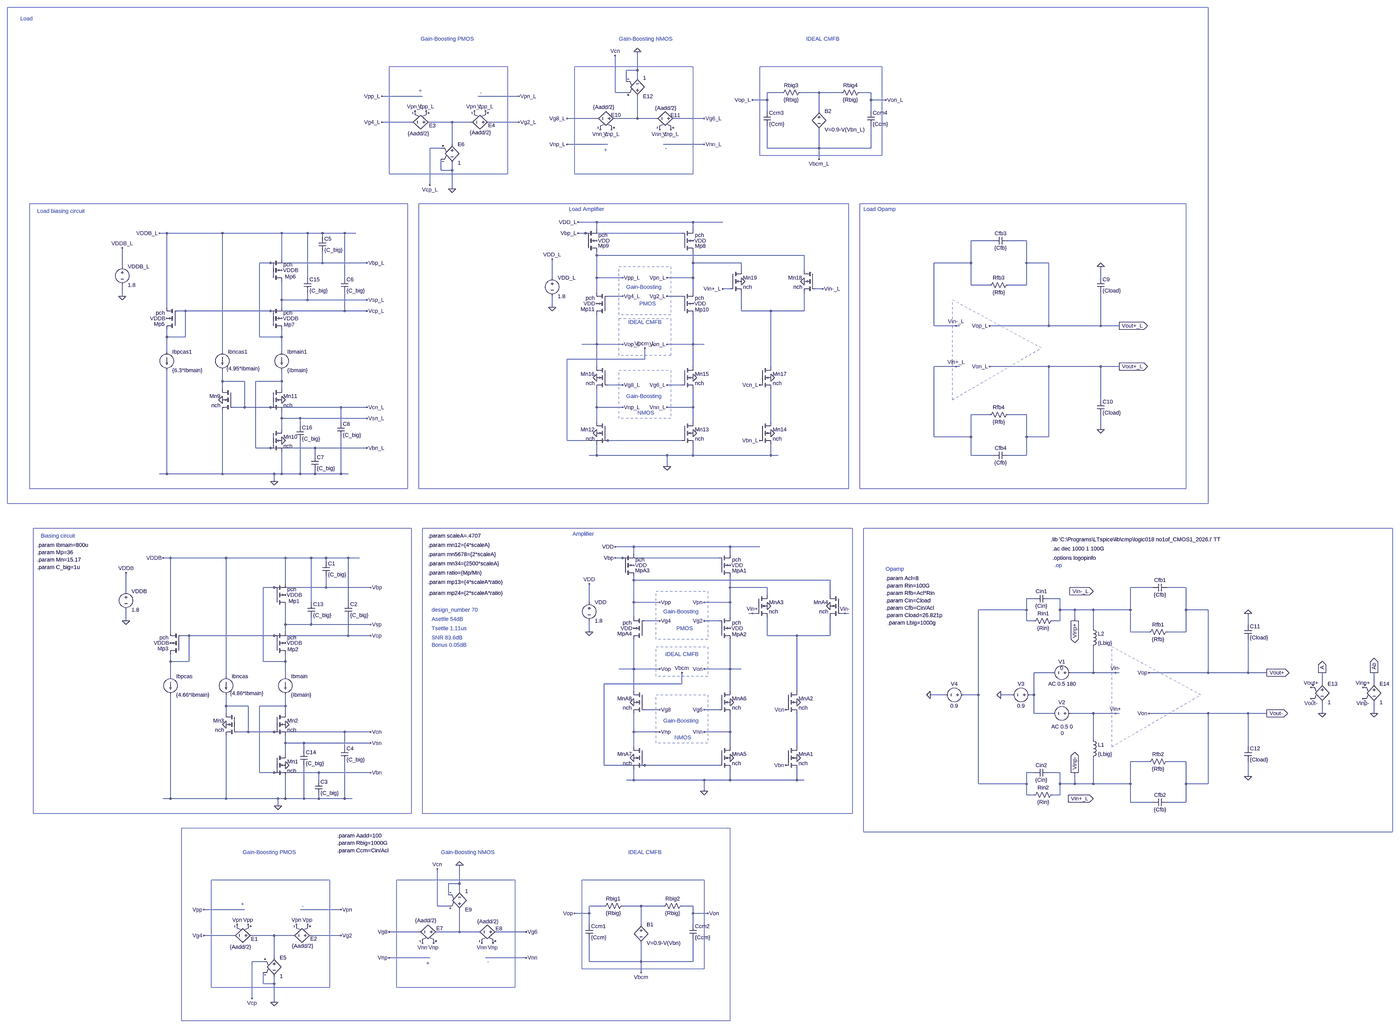
[diagram p0: schematic A_Ab.asc, whole sheet]
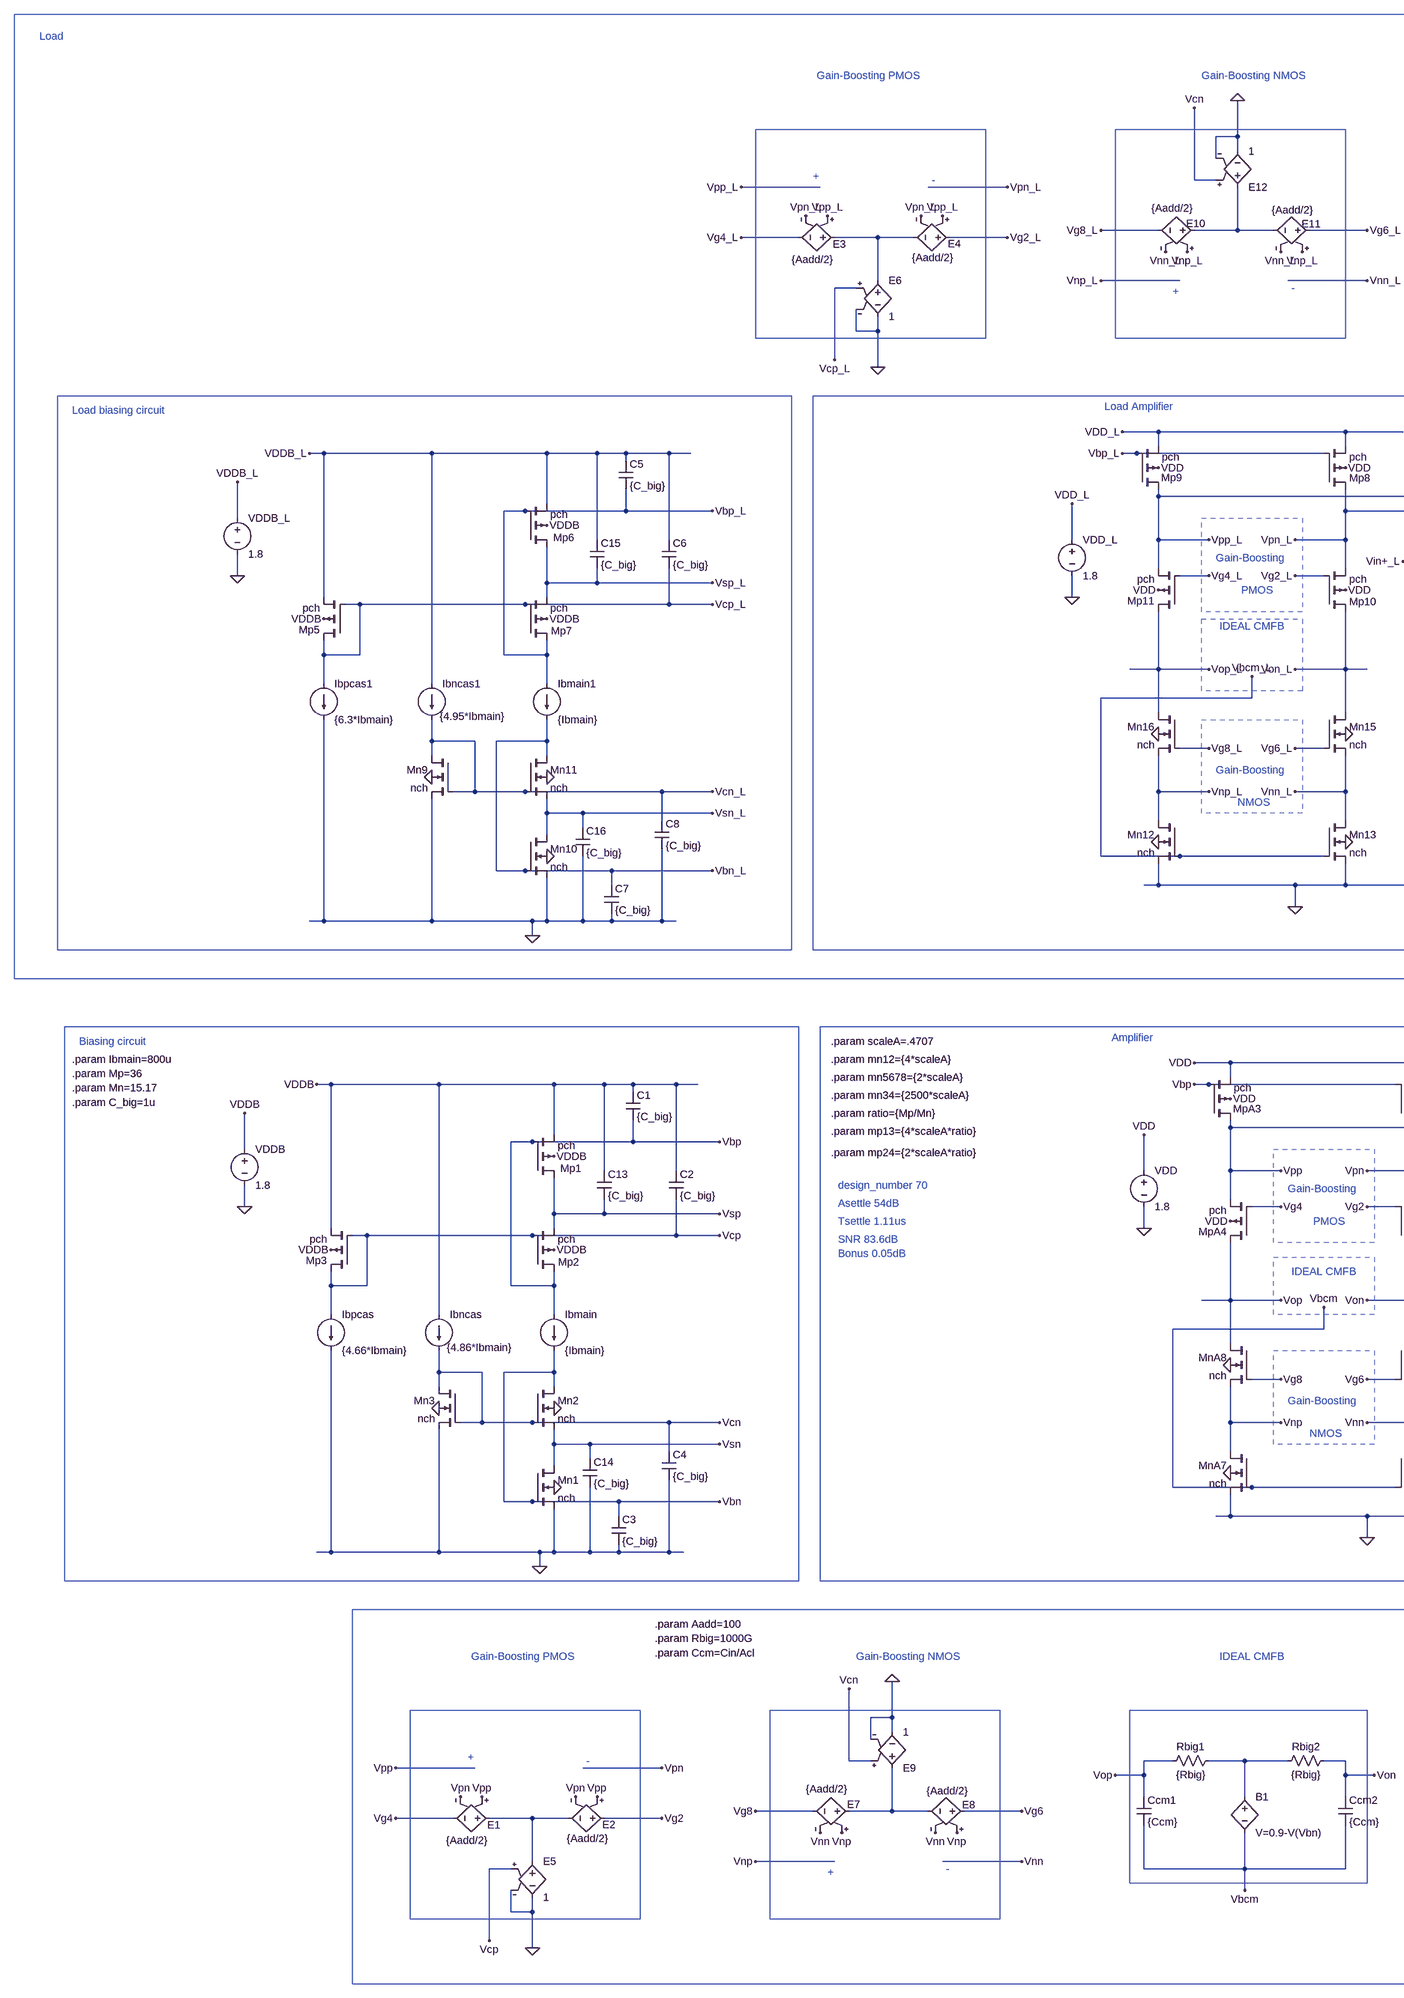
[diagram p1: schematic A_Ab.asc, part, row 1 of 1, column 1 of 2]
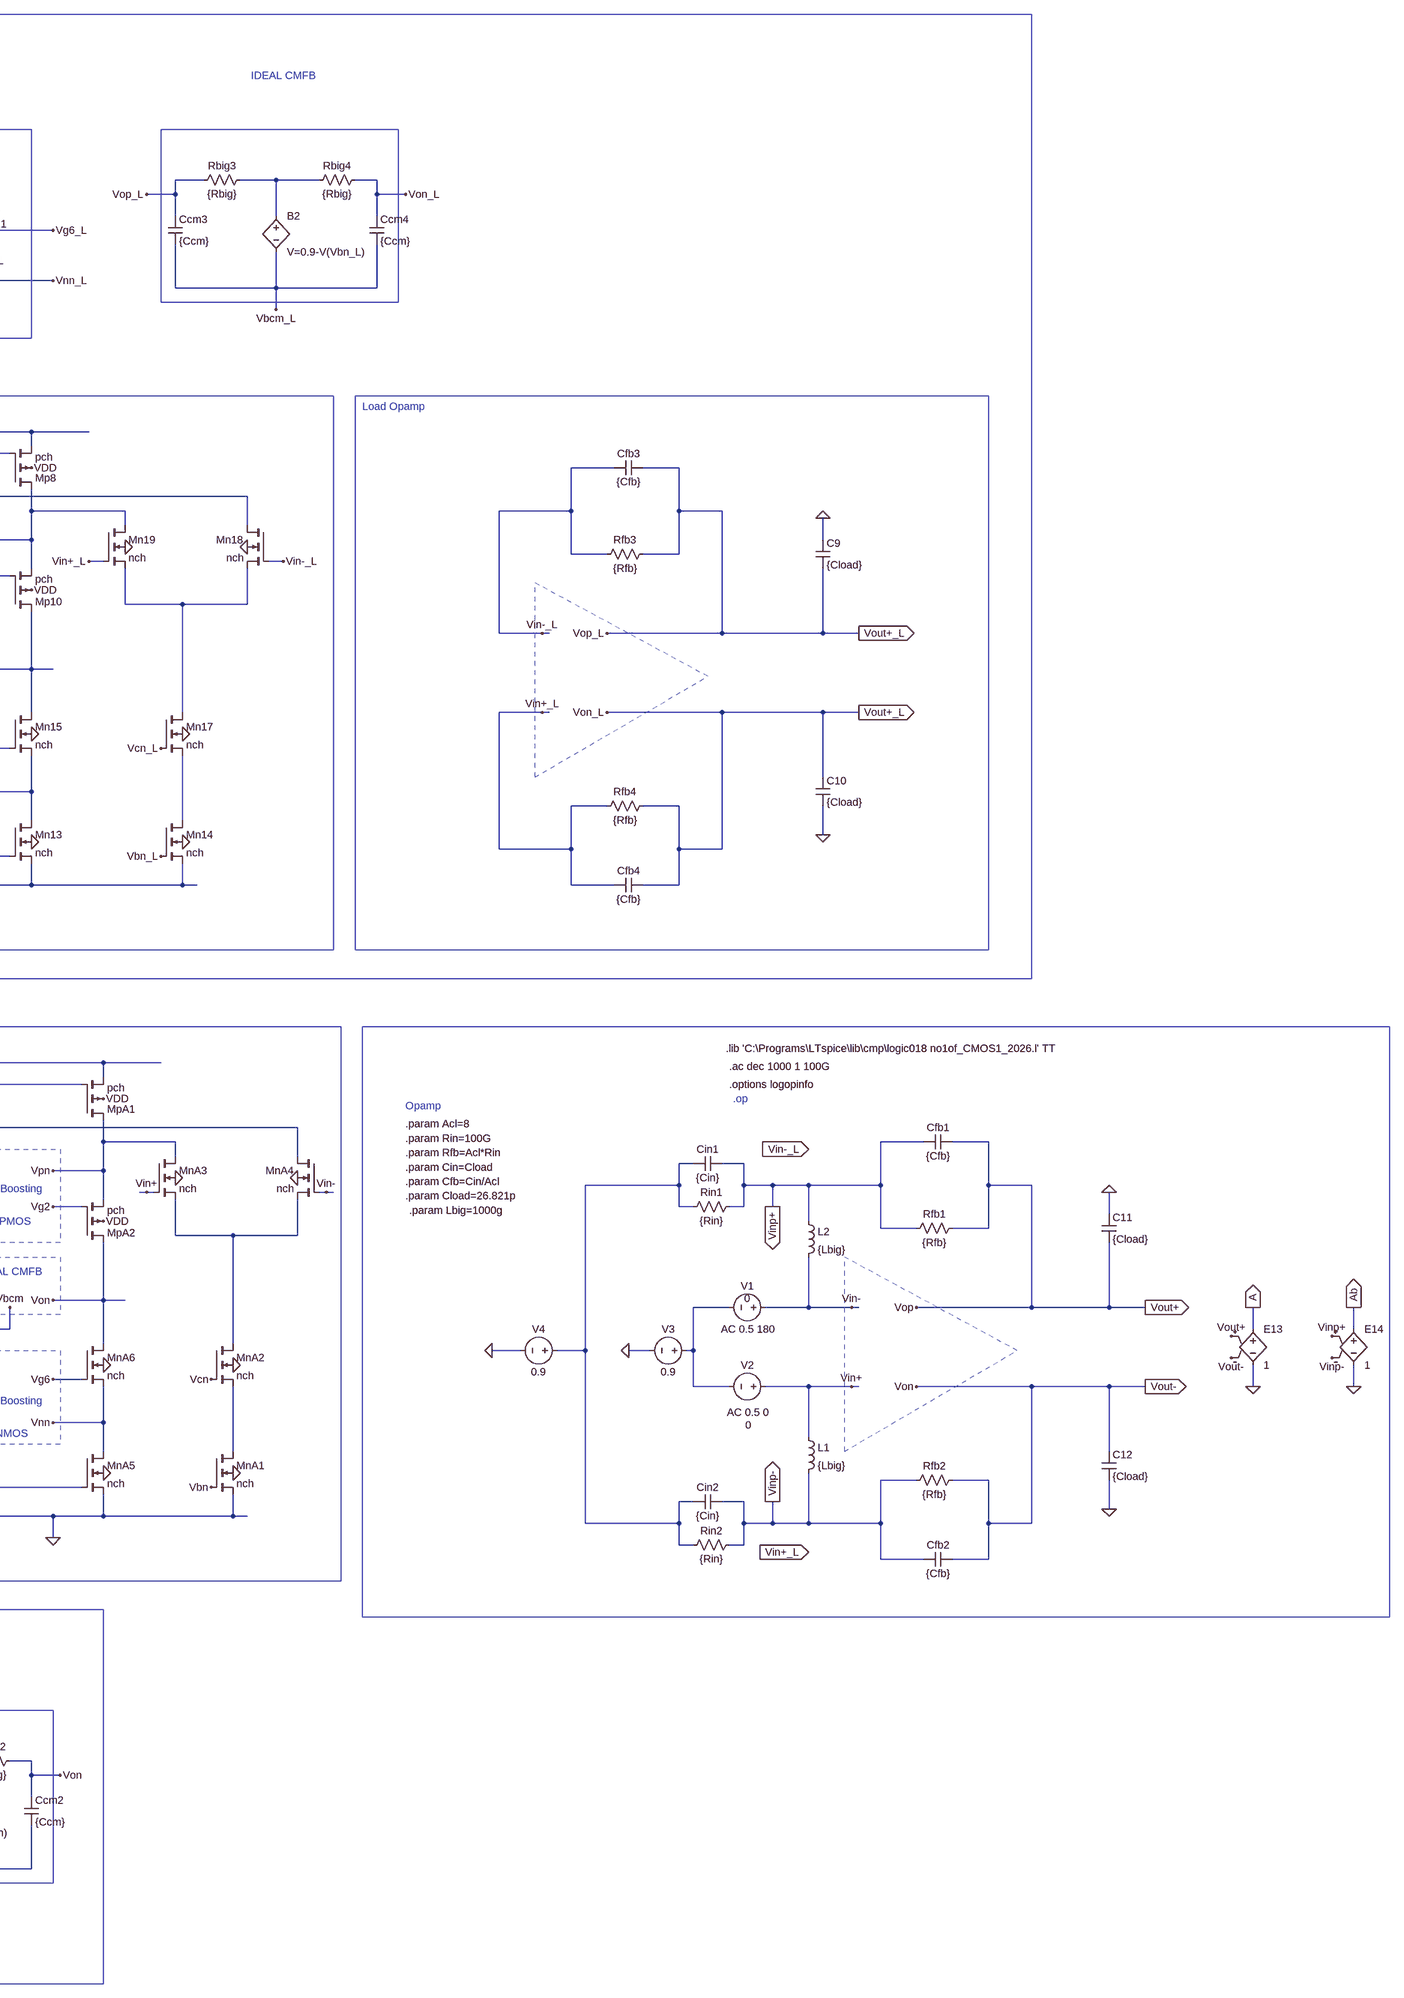
[diagram p2: schematic A_Ab.asc, part, row 1 of 1, column 2 of 2]
A_Ab.asc, the LTspice schematic file:
Version 4.1
SHEET 1 5208 1476
WIRE 1408 -2640 1408 -2720
WIRE 1408 -2640 1360 -2640
WIRE 1408 -2608 1408 -2640
WIRE 1360 -2592 1360 -2640
WIRE 1312 -2544 1312 -2704
WIRE 1360 -2544 1312 -2544
WIRE 2032 -2544 1968 -2544
WIRE 2192 -2544 2112 -2544
WIRE 2288 -2544 2192 -2544
WIRE 2416 -2544 2368 -2544
WIRE 480 -2528 304 -2528
WIRE 896 -2528 720 -2528
WIRE 1968 -2512 1968 -2544
WIRE 1968 -2512 1904 -2512
WIRE 2416 -2512 2416 -2544
WIRE 2480 -2512 2416 -2512
WIRE 1968 -2464 1968 -2512
WIRE 2192 -2464 2192 -2544
WIRE 2416 -2464 2416 -2512
WIRE 1232 -2432 1104 -2432
WIRE 1408 -2432 1408 -2528
WIRE 1408 -2432 1312 -2432
WIRE 1488 -2432 1408 -2432
WIRE 1696 -2432 1568 -2432
WIRE 432 -2416 304 -2416
WIRE 608 -2416 512 -2416
WIRE 688 -2416 608 -2416
WIRE 896 -2416 768 -2416
WIRE 608 -2320 608 -2416
WIRE 1280 -2320 1104 -2320
WIRE 1696 -2320 1520 -2320
WIRE 560 -2304 512 -2304
WIRE 1968 -2304 1968 -2400
WIRE 2192 -2304 2192 -2384
WIRE 2192 -2304 1968 -2304
WIRE 2416 -2304 2416 -2400
WIRE 2416 -2304 2192 -2304
WIRE 2192 -2256 2192 -2304
WIRE 560 -2208 560 -2256
WIRE 608 -2208 608 -2240
WIRE 608 -2208 560 -2208
WIRE 512 -2144 512 -2304
WIRE 608 -2128 608 -2208
WIRE 1232 -1984 1152 -1984
WIRE 1648 -1984 1232 -1984
WIRE 1776 -1984 1648 -1984
WIRE 1232 -1952 1232 -1984
WIRE 1648 -1952 1648 -1984
WIRE -624 -1936 -656 -1936
WIRE -384 -1936 -624 -1936
WIRE -128 -1936 -384 -1936
WIRE -16 -1936 -128 -1936
WIRE 48 -1936 -16 -1936
WIRE 144 -1936 48 -1936
WIRE 192 -1936 144 -1936
WIRE 1184 -1936 1152 -1936
WIRE 1600 -1936 1184 -1936
WIRE 48 -1920 48 -1936
WIRE 2944 -1904 2848 -1904
WIRE 3088 -1904 3008 -1904
WIRE 1232 -1840 1232 -1856
WIRE 2128 -1840 1232 -1840
WIRE -128 -1824 -128 -1936
WIRE -176 -1808 -224 -1808
WIRE 48 -1808 48 -1856
WIRE 48 -1808 -176 -1808
WIRE 240 -1808 48 -1808
WIRE 1648 -1808 1648 -1856
WIRE 1856 -1808 1648 -1808
WIRE 2848 -1808 2848 -1904
WIRE 2848 -1808 2688 -1808
WIRE 3088 -1808 3088 -1904
WIRE 3184 -1808 3088 -1808
WIRE -816 -1792 -816 -1872
WIRE 1856 -1776 1856 -1808
WIRE 2128 -1776 2128 -1840
WIRE -16 -1744 -16 -1936
WIRE 144 -1744 144 -1936
WIRE 1040 -1744 1040 -1824
WIRE 1232 -1744 1232 -1840
WIRE 1344 -1744 1232 -1744
WIRE 1648 -1744 1648 -1808
WIRE 1648 -1744 1536 -1744
WIRE 3408 -1744 3408 -1792
WIRE 2848 -1712 2848 -1808
WIRE 2928 -1712 2848 -1712
WIRE 3088 -1712 3088 -1808
WIRE 3088 -1712 3008 -1712
WIRE 1808 -1696 1776 -1696
WIRE 2208 -1696 2176 -1696
WIRE 1232 -1680 1232 -1744
WIRE 1648 -1680 1648 -1744
WIRE -816 -1664 -816 -1712
WIRE 1344 -1664 1280 -1664
WIRE 1600 -1664 1536 -1664
WIRE -128 -1648 -128 -1728
WIRE -16 -1648 -16 -1680
WIRE -16 -1648 -128 -1648
WIRE 240 -1648 -16 -1648
WIRE -624 -1616 -624 -1936
WIRE -128 -1616 -128 -1648
WIRE 1040 -1616 1040 -1664
WIRE -544 -1600 -576 -1600
WIRE -176 -1600 -544 -1600
WIRE 144 -1600 144 -1680
WIRE 144 -1600 -176 -1600
WIRE 240 -1600 144 -1600
WIRE 1856 -1600 1856 -1680
WIRE 1984 -1600 1856 -1600
WIRE 2128 -1600 2128 -1680
WIRE 2128 -1600 1984 -1600
WIRE 2688 -1536 2688 -1808
WIRE 2784 -1536 2688 -1536
WIRE 2800 -1536 2784 -1536
WIRE 3184 -1536 3184 -1808
WIRE 3184 -1536 2928 -1536
WIRE 3408 -1536 3408 -1680
WIRE 3408 -1536 3184 -1536
WIRE 3488 -1536 3408 -1536
WIRE -624 -1488 -624 -1520
WIRE -544 -1488 -544 -1600
WIRE -544 -1488 -624 -1488
WIRE -224 -1488 -224 -1808
WIRE -128 -1488 -128 -1520
WIRE -128 -1488 -224 -1488
WIRE 1232 -1456 1232 -1584
WIRE 1232 -1456 1168 -1456
WIRE 1344 -1456 1232 -1456
WIRE 1648 -1456 1648 -1584
WIRE 1648 -1456 1536 -1456
WIRE 1696 -1456 1648 -1456
WIRE -624 -1424 -624 -1488
WIRE -384 -1424 -384 -1936
WIRE -128 -1424 -128 -1488
WIRE 1440 -1392 1440 -1440
WIRE 1440 -1392 1104 -1392
WIRE 1232 -1360 1232 -1456
WIRE 1648 -1360 1648 -1456
WIRE 1984 -1360 1984 -1600
WIRE 2784 -1360 2688 -1360
WIRE 2800 -1360 2784 -1360
WIRE 3184 -1360 2928 -1360
WIRE 3408 -1360 3184 -1360
WIRE 3488 -1360 3408 -1360
WIRE -384 -1296 -384 -1344
WIRE -288 -1296 -384 -1296
WIRE -128 -1296 -128 -1344
WIRE -128 -1296 -240 -1296
WIRE 1344 -1280 1280 -1280
WIRE 1600 -1280 1536 -1280
WIRE -384 -1264 -384 -1296
WIRE -128 -1264 -128 -1296
WIRE 3408 -1216 3408 -1360
WIRE -288 -1184 -288 -1296
WIRE -288 -1184 -336 -1184
WIRE -176 -1184 -288 -1184
WIRE 128 -1184 -176 -1184
WIRE 240 -1184 128 -1184
WIRE 1232 -1184 1232 -1264
WIRE 1344 -1184 1232 -1184
WIRE 1648 -1184 1648 -1264
WIRE 1648 -1184 1536 -1184
WIRE 2928 -1152 2848 -1152
WIRE 3088 -1152 3008 -1152
WIRE -128 -1136 -128 -1168
WIRE -48 -1136 -128 -1136
WIRE 240 -1136 -48 -1136
WIRE 128 -1120 128 -1184
WIRE 1232 -1120 1232 -1184
WIRE 1648 -1120 1648 -1184
WIRE 1984 -1120 1984 -1264
WIRE -48 -1104 -48 -1136
WIRE -128 -1088 -128 -1136
WIRE 3408 -1088 3408 -1152
WIRE 2688 -1056 2688 -1360
WIRE 2848 -1056 2848 -1152
WIRE 2848 -1056 2688 -1056
WIRE 3088 -1056 3088 -1152
WIRE 3184 -1056 3184 -1360
WIRE 3184 -1056 3088 -1056
WIRE 1104 -1040 1104 -1392
WIRE 1280 -1040 1104 -1040
WIRE 1600 -1040 1280 -1040
WIRE -240 -1008 -240 -1296
WIRE -176 -1008 -240 -1008
WIRE 16 -1008 -176 -1008
WIRE 240 -1008 16 -1008
WIRE 16 -976 16 -1008
WIRE 1232 -976 1232 -1024
WIRE 1232 -976 1200 -976
WIRE 1536 -976 1232 -976
WIRE 1648 -976 1648 -1024
WIRE 1648 -976 1536 -976
WIRE 1984 -976 1984 -1024
WIRE 1984 -976 1648 -976
WIRE 2016 -976 1984 -976
WIRE 2848 -976 2848 -1056
WIRE 2944 -976 2848 -976
WIRE 3088 -976 3088 -1056
WIRE 3088 -976 3008 -976
WIRE 1536 -928 1536 -976
WIRE -624 -896 -624 -1344
WIRE -624 -896 -656 -896
WIRE -384 -896 -384 -1168
WIRE -384 -896 -624 -896
WIRE -160 -896 -384 -896
WIRE -128 -896 -128 -992
WIRE -128 -896 -160 -896
WIRE -48 -896 -48 -1040
WIRE -48 -896 -128 -896
WIRE 16 -896 16 -912
WIRE 16 -896 -48 -896
WIRE 128 -896 128 -1056
WIRE 128 -896 16 -896
WIRE 160 -896 128 -896
WIRE -160 -864 -160 -896
WIRE 1392 -576 1312 -576
WIRE 1808 -576 1392 -576
WIRE 1936 -576 1808 -576
WIRE 1392 -544 1392 -576
WIRE 1808 -544 1808 -576
WIRE -608 -528 -640 -528
WIRE -368 -528 -608 -528
WIRE -112 -528 -368 -528
WIRE 0 -528 -112 -528
WIRE 64 -528 0 -528
WIRE 160 -528 64 -528
WIRE 208 -528 160 -528
WIRE 1344 -528 1312 -528
WIRE 1760 -528 1344 -528
WIRE 64 -512 64 -528
WIRE 1392 -432 1392 -448
WIRE 2240 -432 1392 -432
WIRE -112 -416 -112 -528
WIRE -160 -400 -208 -400
WIRE 64 -400 64 -448
WIRE 64 -400 -160 -400
WIRE 256 -400 64 -400
WIRE 1808 -400 1808 -448
WIRE 1968 -400 1808 -400
WIRE 3632 -400 3536 -400
WIRE 3776 -400 3696 -400
WIRE -800 -384 -800 -464
WIRE 1968 -368 1968 -400
WIRE 2240 -368 2240 -432
WIRE 3120 -352 3088 -352
WIRE 3232 -352 3184 -352
WIRE 0 -336 0 -528
WIRE 160 -336 160 -528
WIRE 1200 -336 1200 -416
WIRE 1392 -336 1392 -432
WIRE 1504 -336 1392 -336
WIRE 1808 -336 1808 -400
WIRE 1808 -336 1696 -336
WIRE 3088 -304 3088 -352
WIRE 3088 -304 2880 -304
WIRE 3232 -304 3232 -352
WIRE 3296 -304 3232 -304
WIRE 3376 -304 3296 -304
WIRE 3536 -304 3536 -400
WIRE 3536 -304 3376 -304
WIRE 3776 -304 3776 -400
WIRE 3872 -304 3776 -304
WIRE 1904 -288 1888 -288
WIRE 1920 -288 1904 -288
WIRE 2304 -288 2288 -288
WIRE 2320 -288 2304 -288
WIRE 1392 -272 1392 -336
WIRE 1808 -272 1808 -336
WIRE -800 -256 -800 -304
WIRE 1504 -256 1440 -256
WIRE 1760 -256 1696 -256
WIRE 3088 -256 3088 -304
WIRE 3120 -256 3088 -256
WIRE 3232 -256 3232 -304
WIRE 3232 -256 3200 -256
WIRE 3296 -256 3296 -304
WIRE -112 -240 -112 -320
WIRE 0 -240 0 -272
WIRE 0 -240 -112 -240
WIRE 256 -240 0 -240
WIRE 4096 -240 4096 -288
WIRE 3376 -224 3376 -304
WIRE -608 -208 -608 -528
WIRE -112 -208 -112 -240
WIRE 1200 -208 1200 -256
WIRE 3536 -208 3536 -304
WIRE 3616 -208 3536 -208
WIRE 3776 -208 3776 -304
WIRE 3776 -208 3696 -208
WIRE -528 -192 -560 -192
WIRE -160 -192 -528 -192
WIRE 160 -192 160 -272
WIRE 160 -192 -160 -192
WIRE 256 -192 160 -192
WIRE 1968 -192 1968 -272
WIRE 2096 -192 1968 -192
WIRE 2240 -192 2240 -272
WIRE 2240 -192 2096 -192
WIRE -608 -80 -608 -112
WIRE -528 -80 -528 -192
WIRE -528 -80 -608 -80
WIRE -208 -80 -208 -400
WIRE -112 -80 -112 -112
WIRE -112 -80 -208 -80
WIRE 1392 -48 1392 -176
WIRE 1392 -48 1328 -48
WIRE 1504 -48 1392 -48
WIRE 1808 -48 1808 -176
WIRE 1808 -48 1696 -48
WIRE 1856 -48 1808 -48
WIRE 3200 -32 3120 -32
WIRE 3376 -32 3376 -144
WIRE 3376 -32 3280 -32
WIRE 3472 -32 3376 -32
WIRE 3488 -32 3472 -32
WIRE 3872 -32 3872 -304
WIRE 3872 -32 3616 -32
WIRE 4096 -32 4096 -176
WIRE 4096 -32 3872 -32
WIRE 4176 -32 4096 -32
WIRE -608 -16 -608 -80
WIRE -368 -16 -368 -528
WIRE -112 -16 -112 -80
WIRE 1600 16 1600 -32
WIRE 1600 16 1264 16
WIRE 4416 16 4416 -32
WIRE 4640 16 4640 -32
WIRE 1392 48 1392 -48
WIRE 1808 48 1808 -48
WIRE 2096 48 2096 -192
WIRE 2736 64 2672 64
WIRE 2880 64 2880 -304
WIRE 2880 64 2816 64
WIRE 3024 64 2976 64
WIRE 3120 64 3120 -32
WIRE 3120 64 3104 64
WIRE -368 112 -368 64
WIRE -272 112 -368 112
WIRE -112 112 -112 64
WIRE -112 112 -224 112
WIRE 1504 128 1440 128
WIRE 1760 128 1696 128
WIRE -368 144 -368 112
WIRE -112 144 -112 112
WIRE 3120 144 3120 64
WIRE 3200 144 3120 144
WIRE 3376 144 3280 144
WIRE 3472 144 3376 144
WIRE 3488 144 3472 144
WIRE 3872 144 3616 144
WIRE 4096 144 3872 144
WIRE 4176 144 4096 144
WIRE 4416 144 4416 96
WIRE 4640 144 4640 96
WIRE -272 224 -272 112
WIRE -272 224 -320 224
WIRE -160 224 -272 224
WIRE 144 224 -160 224
WIRE 256 224 144 224
WIRE 1392 224 1392 144
WIRE 1504 224 1392 224
WIRE 1808 224 1808 144
WIRE 1808 224 1696 224
WIRE 3376 256 3376 144
WIRE -112 272 -112 240
WIRE -32 272 -112 272
WIRE 256 272 -32 272
WIRE 144 288 144 224
WIRE 1392 288 1392 224
WIRE 1808 288 1808 224
WIRE 2096 288 2096 144
WIRE 4096 288 4096 144
WIRE -32 304 -32 272
WIRE -112 320 -112 272
WIRE 3616 352 3536 352
WIRE 3776 352 3696 352
WIRE 1264 368 1264 16
WIRE 1440 368 1264 368
WIRE 1760 368 1440 368
WIRE -224 400 -224 112
WIRE -160 400 -224 400
WIRE 32 400 -160 400
WIRE 256 400 32 400
WIRE 3120 400 3088 400
WIRE 3232 400 3184 400
WIRE 4096 416 4096 352
WIRE 32 432 32 400
WIRE 1392 432 1392 384
WIRE 1392 432 1360 432
WIRE 1696 432 1392 432
WIRE 1808 432 1808 384
WIRE 1808 432 1696 432
WIRE 2096 432 2096 384
WIRE 2096 432 1808 432
WIRE 2128 432 2096 432
WIRE 2880 448 2880 64
WIRE 3088 448 3088 400
WIRE 3088 448 2880 448
WIRE 3232 448 3232 400
WIRE 3296 448 3296 400
WIRE 3296 448 3232 448
WIRE 3376 448 3376 336
WIRE 3376 448 3296 448
WIRE 3536 448 3536 352
WIRE 3536 448 3376 448
WIRE 3776 448 3776 352
WIRE 3872 448 3872 144
WIRE 3872 448 3776 448
WIRE 1696 480 1696 432
WIRE 3088 496 3088 448
WIRE 3120 496 3088 496
WIRE 3232 496 3232 448
WIRE 3232 496 3200 496
WIRE -608 512 -608 64
WIRE -608 512 -640 512
WIRE -368 512 -368 240
WIRE -368 512 -608 512
WIRE -144 512 -368 512
WIRE -112 512 -112 416
WIRE -112 512 -144 512
WIRE -32 512 -32 368
WIRE -32 512 -112 512
WIRE 32 512 32 496
WIRE 32 512 -32 512
WIRE 144 512 144 352
WIRE 144 512 32 512
WIRE 176 512 144 512
WIRE 3536 528 3536 448
WIRE 3632 528 3536 528
WIRE 3776 528 3776 448
WIRE 3776 528 3696 528
WIRE -144 544 -144 512
WIRE 640 880 640 800
WIRE 640 880 592 880
WIRE 640 912 640 880
WIRE 592 928 592 880
WIRE 544 976 544 816
WIRE 592 976 544 976
WIRE 1264 976 1200 976
WIRE 1424 976 1344 976
WIRE 1520 976 1424 976
WIRE 1648 976 1600 976
WIRE -288 992 -464 992
WIRE 128 992 -48 992
WIRE 1200 1008 1200 976
WIRE 1200 1008 1136 1008
WIRE 1648 1008 1648 976
WIRE 1712 1008 1648 1008
WIRE 1200 1056 1200 1008
WIRE 1424 1056 1424 976
WIRE 1648 1056 1648 1008
WIRE 464 1088 336 1088
WIRE 640 1088 640 992
WIRE 640 1088 544 1088
WIRE 720 1088 640 1088
WIRE 928 1088 800 1088
WIRE -336 1104 -464 1104
WIRE -160 1104 -256 1104
WIRE -80 1104 -160 1104
WIRE 128 1104 0 1104
WIRE -160 1200 -160 1104
WIRE 512 1200 336 1200
WIRE 928 1200 752 1200
WIRE -208 1216 -256 1216
WIRE 1200 1216 1200 1120
WIRE 1424 1216 1424 1136
WIRE 1424 1216 1200 1216
WIRE 1648 1216 1648 1120
WIRE 1648 1216 1424 1216
WIRE 1424 1264 1424 1216
WIRE -208 1312 -208 1264
WIRE -160 1312 -160 1280
WIRE -160 1312 -208 1312
WIRE -256 1376 -256 1216
WIRE -160 1392 -160 1312
FLAG -608 -160 VDDB
FLAG -112 -368 VDDB
FLAG -112 -160 VDDB
FLAG -368 192 0
FLAG -112 192 0
FLAG -112 368 0
FLAG 1136 1008 Vop
FLAG 1712 1008 Von
FLAG 1424 1264 Vbcm
FLAG -464 992 Vpp
FLAG 128 992 Vpn
FLAG -464 1104 Vg4
FLAG 128 1104 Vg2
FLAG -160 1392 0
FLAG -272 1056 Vpp
FLAG -16 1056 Vpp
FLAG -320 1056 Vpn
FLAG -64 1056 Vpn
FLAG 1504 -256 Vg4
FLAG 1696 -256 Vg2
FLAG 1504 -336 Vpp
FLAG 1696 -336 Vpn
FLAG 1504 -48 Vop
FLAG 1696 -48 Von
FLAG 1504 128 Vg8
FLAG 1696 128 Vg6
FLAG 1504 224 Vnp
FLAG 1696 224 Vnn
FLAG 1600 -32 Vbcm
FLAG 1392 96 0
FLAG 1392 336 0
FLAG 1808 96 0
FLAG 1808 336 0
FLAG 2096 96 0
FLAG 2096 336 0
FLAG 1968 -320 0
FLAG 2240 -320 0
FLAG -144 544 0
FLAG 256 -400 Vbp
FLAG 256 -192 Vcp
FLAG 256 224 Vcn
FLAG 256 400 Vbn
FLAG 1312 -528 Vbp
FLAG 2048 368 Vbn
FLAG 2048 128 Vcn
FLAG 1696 480 0
FLAG -800 -256 0
FLAG 1200 -208 0
FLAG 1200 -416 VDD
FLAG 1392 -496 VDD
FLAG 1808 -496 VDD
FLAG 1392 -224 VDD
FLAG 1808 -224 VDD
FLAG 1904 -288 Vin+
FLAG 2304 -288 Vin-
FLAG 3472 -32 Vin-
FLAG 3616 -32 Vop
FLAG 3472 144 Vin+
FLAG 3616 144 Von
FLAG 4096 -288 0
FLAG 4096 416 0
FLAG 256 -240 Vsp
FLAG 256 272 Vsn
FLAG -256 1376 Vcp
FLAG 640 800 0
FLAG 336 1200 Vnp
FLAG 928 1200 Vnn
FLAG 336 1088 Vg8
FLAG 928 1088 Vg6
FLAG 528 1136 Vnp
FLAG 784 1136 Vnp
FLAG 480 1136 Vnn
FLAG 736 1136 Vnn
FLAG 544 816 Vcn
FLAG 4176 -32 Vout+
IOPIN 4176 -32 Out
FLAG 4176 144 Vout-
IOPIN 4176 144 Out
FLAG -624 -1568 VDDB
FLAG -128 -1776 VDDB
FLAG -128 -1568 VDDB
FLAG -384 -1216 0
FLAG -128 -1216 0
FLAG -128 -1040 0
FLAG 1344 -1664 Vg4_L
FLAG 1536 -1664 Vg2_L
FLAG 1344 -1744 Vpp_L
FLAG 1536 -1744 Vpn_L
FLAG 1344 -1456 Vop_L
FLAG 1536 -1456 Von_L
FLAG 1344 -1280 Vg8_L
FLAG 1536 -1280 Vg6_L
FLAG 1344 -1184 Vnp_L
FLAG 1536 -1184 Vnn_L
FLAG 1440 -1440 Vbcm_L
FLAG 1232 -1312 0
FLAG 1232 -1072 0
FLAG 1648 -1312 0
FLAG 1648 -1072 0
FLAG 1984 -1312 0
FLAG 1984 -1072 0
FLAG 1856 -1728 0
FLAG 2128 -1728 0
FLAG -160 -864 0
FLAG 240 -1808 Vbp_L
FLAG 240 -1600 Vcp_L
FLAG 240 -1184 Vcn_L
FLAG 240 -1008 Vbn_L
FLAG 1152 -1936 Vbp_L
FLAG 1936 -1040 Vbn_L
FLAG 1936 -1280 Vcn_L
FLAG 1536 -928 0
FLAG -816 -1664 0
FLAG -816 -1872 VDDB_L
FLAG 1040 -1616 0
FLAG 1040 -1824 VDD_L
FLAG 1232 -1904 VDD
FLAG 1648 -1904 VDD
FLAG 1232 -1632 VDD
FLAG 1648 -1632 VDD
FLAG 1776 -1696 Vin+_L
FLAG 2208 -1696 Vin-_L
FLAG 2784 -1536 Vin-_L
FLAG 2928 -1536 Vop_L
FLAG 2784 -1360 Vin+_L
FLAG 2928 -1360 Von_L
FLAG 3408 -1792 0
FLAG 3408 -1088 0
FLAG 240 -1648 Vsp_L
FLAG 240 -1136 Vsn_L
FLAG 3488 -1536 Vout+_L
IOPIN 3488 -1536 Out
FLAG 3488 -1360 Vout+_L
IOPIN 3488 -1360 Out
FLAG 1904 -2512 Vop_L
FLAG 2480 -2512 Von_L
FLAG 2192 -2256 Vbcm_L
FLAG 304 -2528 Vpp_L
FLAG 896 -2528 Vpn_L
FLAG 304 -2416 Vg4_L
FLAG 896 -2416 Vg2_L
FLAG 608 -2128 0
FLAG 496 -2464 Vpp_L
FLAG 752 -2464 Vpp_L
FLAG 448 -2464 Vpn_L
FLAG 704 -2464 Vpn_L
FLAG 512 -2144 Vcp_L
FLAG 1408 -2720 0
FLAG 1104 -2320 Vnp_L
FLAG 1696 -2320 Vnn_L
FLAG 1104 -2432 Vg8_L
FLAG 1696 -2432 Vg6_L
FLAG 1296 -2384 Vnp_L
FLAG 1552 -2384 Vnp_L
FLAG 1248 -2384 Vnn_L
FLAG 1504 -2384 Vnn_L
FLAG 1312 -2704 Vcn
FLAG 2976 64 0
FLAG 2672 64 0
FLAG 3296 400 Vinp-
IOPIN 3296 400 Out
FLAG 3296 -256 Vinp+
IOPIN 3296 -256 Out
FLAG 4368 32 Vout+
FLAG 4368 80 Vout-
FLAG 4592 32 Vinp+
FLAG 4592 80 Vinp-
FLAG 4416 144 0
FLAG 4640 144 0
FLAG 4416 -32 A
IOPIN 4416 -32 Out
FLAG 4640 -32 Ab
IOPIN 4640 -32 Out
FLAG 3376 -384 Vin-_L
IOPIN 3376 -384 In
FLAG 3376 512 Vin+_L
IOPIN 3376 512 In
FLAG -800 -464 VDDB
FLAG -640 -528 VDDB
FLAG -656 -1936 VDDB_L
FLAG 1152 -1984 VDD_L
FLAG 1312 -576 VDD
SYMBOL nmos4 -320 144 M0
SYMATTR InstName Mn3
SYMATTR Value nch
SYMATTR Value2 l=.18u w=1u m={Mn}
SYMBOL nmos4 -160 320 R0
SYMATTR InstName Mn1
SYMATTR Value nch
SYMATTR Value2 l=.18u w=1u m={Mn}
SYMBOL nmos4 -160 144 R0
SYMATTR InstName Mn2
SYMATTR Value nch
SYMATTR Value2 l=.18u w=1u m={Mn}
SYMBOL pmos4 -560 -112 R180
WINDOW 0 56 24 Left 2
SYMATTR InstName Mp3
SYMATTR Value pch
SYMATTR Value2 l=.18u w=1u m={Mp}
SYMBOL pmos4 -160 -320 M180
WINDOW 0 62 21 Left 2
SYMATTR InstName Mp1
SYMATTR Value pch
SYMATTR Value2 l=.18u w=1u m={Mp}
SYMBOL pmos4 -160 -112 M180
WINDOW 0 57 21 Left 2
SYMATTR InstName Mp2
SYMATTR Value2 l=.18u w=1u m={Mp}
SYMATTR Value pch
SYMBOL current -608 -16 R0
WINDOW 123 0 0 Left 0
WINDOW 39 0 0 Left 0
SYMATTR InstName Ibpcas
SYMATTR Value {4.66*Ibmain}
SYMBOL current -368 -16 R0
WINDOW 3 18 73 Left 2
WINDOW 123 0 0 Left 0
WINDOW 39 0 0 Left 0
SYMATTR Value {4.86*Ibmain}
SYMATTR InstName Ibncas
SYMBOL current -112 -16 R0
WINDOW 123 0 0 Left 0
WINDOW 39 0 0 Left 0
SYMATTR InstName Ibmain
SYMATTR Value {Ibmain}
SYMBOL cap 48 -512 R0
SYMATTR InstName C1
SYMATTR Value {C_big}
SYMBOL cap 144 -336 R0
SYMATTR InstName C2
SYMATTR Value {C_big}
SYMBOL cap 16 432 R0
SYMATTR InstName C3
SYMATTR Value {C_big}
SYMBOL cap 128 288 R0
SYMATTR InstName C4
SYMATTR Value {C_big}
SYMBOL res 1360 960 R90
WINDOW 0 0 56 VBottom 2
WINDOW 3 32 56 VTop 2
SYMATTR InstName Rbig1
SYMATTR Value {Rbig}
SYMBOL res 1616 960 R90
WINDOW 0 0 56 VBottom 2
WINDOW 3 32 56 VTop 2
SYMATTR InstName Rbig2
SYMATTR Value {Rbig}
SYMBOL cap 1184 1056 R0
SYMATTR InstName Ccm1
SYMATTR Value {Ccm}
SYMBOL cap 1632 1056 R0
SYMATTR InstName Ccm2
SYMATTR Value {Ccm}
SYMBOL e -240 1104 R90
WINDOW 0 15 -9 VRight 2
WINDOW 3 49 19 VRight 2
SYMATTR InstName E1
SYMATTR Value {Aadd/2}
SYMBOL e 16 1104 R90
WINDOW 0 14 -9 VRight 2
WINDOW 3 45 7 VRight 2
SYMATTR InstName E2
SYMATTR Value {Aadd/2}
SYMBOL pmos4 1760 -448 M180
WINDOW 0 56 25 Left 2
SYMATTR InstName MpA1
SYMATTR Value pch
SYMATTR Value2 l=.18u w=1u m={mp13}
SYMBOL pmos4 1344 -448 M180
WINDOW 0 54 26 Left 2
SYMATTR InstName MpA3
SYMATTR Value pch
SYMATTR Value2 l=.18u w=1u m={mp13}
SYMBOL pmos4 1760 -176 M180
WINDOW 0 56 22 Left 2
SYMATTR InstName MpA2
SYMATTR Value pch
SYMATTR Value2 l=.18u w=1u m={mp24}
SYMBOL pmos4 1440 -176 R180
WINDOW 0 56 24 Left 2
SYMATTR InstName MpA4
SYMATTR Value pch
SYMATTR Value2 l=.18u w=1u m={mp24}
SYMBOL nmos4 1440 288 M0
SYMATTR InstName MnA7
SYMATTR Value nch
SYMATTR Value2 l=.18u w=1u m={mn5678}
SYMBOL nmos4 1760 288 R0
SYMATTR InstName MnA5
SYMATTR Value nch
SYMATTR Value2 l=.18u w=1u m={mn5678}
SYMBOL nmos4 2048 288 R0
SYMATTR InstName MnA1
SYMATTR Value nch
SYMATTR Value2 l=.18u w=1u m={mn12}
SYMBOL nmos4 1760 48 R0
SYMATTR InstName MnA6
SYMATTR Value nch
SYMATTR Value2 l=.18u w=1u m={mn5678}
SYMBOL nmos4 1440 48 M0
SYMATTR InstName MnA8
SYMATTR Value nch
SYMATTR Value2 l=.18u w=1u m={mn5678}
SYMBOL nmos4 2048 48 R0
SYMATTR InstName MnA2
SYMATTR Value nch
SYMATTR Value2 l=.18u w=1u m={mn12}
SYMBOL nmos4 2288 -368 M0
SYMATTR InstName MnA4
SYMATTR Value nch
SYMATTR Value2 l=.18u w=1u m={mn34}
SYMBOL nmos4 1920 -368 R0
SYMATTR InstName MnA3
SYMATTR Value nch
SYMATTR Value2 l=.18u w=1u m={mn34}
SYMBOL voltage -800 -400 R0
WINDOW 123 0 0 Left 0
WINDOW 39 0 0 Left 0
SYMATTR InstName VDDB
SYMATTR Value 1.8
SYMBOL voltage 1200 -352 R0
WINDOW 123 0 0 Left 0
WINDOW 39 0 0 Left 0
SYMATTR InstName VDD
SYMATTR Value 1.8
SYMBOL res 3216 -272 R90
WINDOW 0 0 56 VBottom 2
WINDOW 3 32 56 VTop 2
SYMATTR InstName Rin1
SYMATTR Value {Rin}
SYMBOL res 3712 -224 R90
WINDOW 0 0 56 VBottom 2
WINDOW 3 32 56 VTop 2
SYMATTR InstName Rfb1
SYMATTR Value {Rfb}
SYMBOL res 3216 480 R90
WINDOW 0 0 56 VBottom 2
WINDOW 3 32 56 VTop 2
SYMATTR InstName Rin2
SYMATTR Value {Rin}
SYMBOL res 3712 336 R90
WINDOW 0 0 56 VBottom 2
WINDOW 3 32 56 VTop 2
SYMATTR InstName Rfb2
SYMATTR Value {Rfb}
SYMBOL cap 3184 -368 R90
WINDOW 0 0 32 VBottom 2
WINDOW 3 32 32 VTop 2
SYMATTR InstName Cin1
SYMATTR Value {Cin}
SYMBOL cap 3696 -416 R90
WINDOW 0 0 32 VBottom 2
WINDOW 3 32 32 VTop 2
SYMATTR InstName Cfb1
SYMATTR Value {Cfb}
SYMBOL cap 3184 384 R90
WINDOW 0 0 32 VBottom 2
WINDOW 3 32 32 VTop 2
SYMATTR InstName Cin2
SYMATTR Value {Cin}
SYMBOL cap 3696 512 R90
WINDOW 0 0 32 VBottom 2
WINDOW 3 32 32 VTop 2
SYMATTR InstName Cfb2
SYMATTR Value {Cfb}
SYMBOL cap 4080 -240 R0
SYMATTR InstName C11
SYMATTR Value {Cload}
SYMBOL cap 4080 288 R0
SYMATTR InstName C12
SYMATTR Value {Cload}
SYMBOL cap -16 -336 R0
SYMATTR InstName C13
SYMATTR Value {C_big}
SYMBOL cap -48 304 R0
SYMATTR InstName C14
SYMATTR Value {C_big}
SYMBOL bv 1424 1040 R0
SYMATTR InstName B1
SYMATTR Value V=0.9-V(Vbn)
SYMBOL e -160 1184 R0
SYMATTR InstName E5
SYMATTR Value 1
SYMBOL e 560 1088 M270
WINDOW 0 15 -9 VRight 2
WINDOW 3 49 19 VRight 2
SYMATTR InstName E7
SYMATTR Value {Aadd/2}
SYMBOL e 816 1088 M270
WINDOW 0 14 -9 VRight 2
WINDOW 3 45 7 VRight 2
SYMATTR InstName E8
SYMATTR Value {Aadd/2}
SYMBOL e 640 1008 M180
SYMATTR InstName E9
SYMATTR Value 1
SYMBOL nmos4 -336 -1264 M0
SYMATTR InstName Mn9
SYMATTR Value nch
SYMATTR Value2 l=.18u w=1u m={Mn}
SYMBOL nmos4 -176 -1088 R0
SYMATTR InstName Mn10
SYMATTR Value nch
SYMATTR Value2 l=.18u w=1u m={Mn}
SYMBOL nmos4 -176 -1264 R0
SYMATTR InstName Mn11
SYMATTR Value nch
SYMATTR Value2 l=.18u w=1u m={Mn}
SYMBOL pmos4 -576 -1520 R180
WINDOW 0 56 24 Left 2
SYMATTR InstName Mp5
SYMATTR Value pch
SYMATTR Value2 l=.18u w=1u m={Mp}
SYMBOL pmos4 -176 -1728 M180
WINDOW 0 62 21 Left 2
SYMATTR InstName Mp6
SYMATTR Value pch
SYMATTR Value2 l=.18u w=1u m={Mp}
SYMBOL pmos4 -176 -1520 M180
WINDOW 0 57 21 Left 2
SYMATTR InstName Mp7
SYMATTR Value2 l=.18u w=1u m={Mp}
SYMATTR Value pch
SYMBOL current -624 -1424 R0
WINDOW 123 0 0 Left 0
WINDOW 39 0 0 Left 0
SYMATTR InstName Ibpcas1
SYMATTR Value {6.3*Ibmain}
SYMBOL current -384 -1424 R0
WINDOW 3 18 73 Left 2
WINDOW 123 0 0 Left 0
WINDOW 39 0 0 Left 0
SYMATTR Value {4.95*Ibmain}
SYMATTR InstName Ibncas1
SYMBOL current -128 -1424 R0
WINDOW 123 0 0 Left 0
WINDOW 39 0 0 Left 0
SYMATTR InstName Ibmain1
SYMATTR Value {Ibmain}
SYMBOL cap 32 -1920 R0
SYMATTR InstName C5
SYMATTR Value {C_big}
SYMBOL cap 128 -1744 R0
SYMATTR InstName C6
SYMATTR Value {C_big}
SYMBOL cap 0 -976 R0
SYMATTR InstName C7
SYMATTR Value {C_big}
SYMBOL cap 112 -1120 R0
SYMATTR InstName C8
SYMATTR Value {C_big}
SYMBOL pmos4 1600 -1856 M180
WINDOW 0 56 25 Left 2
SYMATTR InstName Mp8
SYMATTR Value pch
SYMATTR Value2 l=.18u w=1u m={mp13}
SYMBOL pmos4 1184 -1856 M180
WINDOW 0 54 26 Left 2
SYMATTR InstName Mp9
SYMATTR Value pch
SYMATTR Value2 l=.18u w=1u m={mp13}
SYMBOL pmos4 1600 -1584 M180
WINDOW 0 56 22 Left 2
SYMATTR InstName Mp10
SYMATTR Value pch
SYMATTR Value2 l=.18u w=1u m={mp24}
SYMBOL pmos4 1280 -1584 R180
WINDOW 0 56 24 Left 2
SYMATTR InstName Mp11
SYMATTR Value pch
SYMATTR Value2 l=.18u w=1u m={mp24}
SYMBOL nmos4 1280 -1120 M0
SYMATTR InstName Mn12
SYMATTR Value nch
SYMATTR Value2 l=.18u w=1u m={mn5678}
SYMBOL nmos4 1600 -1120 R0
SYMATTR InstName Mn13
SYMATTR Value nch
SYMATTR Value2 l=.18u w=1u m={mn5678}
SYMBOL nmos4 1936 -1120 R0
SYMATTR InstName Mn14
SYMATTR Value nch
SYMATTR Value2 l=.18u w=1u m={mn12}
SYMBOL nmos4 1600 -1360 R0
SYMATTR InstName Mn15
SYMATTR Value nch
SYMATTR Value2 l=.18u w=1u m={mn5678}
SYMBOL nmos4 1280 -1360 M0
SYMATTR InstName Mn16
SYMATTR Value nch
SYMATTR Value2 l=.18u w=1u m={mn5678}
SYMBOL nmos4 1936 -1360 R0
SYMATTR InstName Mn17
SYMATTR Value nch
SYMATTR Value2 l=.18u w=1u m={mn12}
SYMBOL nmos4 2176 -1776 M0
SYMATTR InstName Mn18
SYMATTR Value nch
SYMATTR Value2 l=.18u w=1u m={mn34}
SYMBOL nmos4 1808 -1776 R0
SYMATTR InstName Mn19
SYMATTR Value nch
SYMATTR Value2 l=.18u w=1u m={mn34}
SYMBOL voltage -816 -1808 R0
WINDOW 123 0 0 Left 0
WINDOW 39 0 0 Left 0
SYMATTR InstName VDDB_L
SYMATTR Value 1.8
SYMBOL voltage 1040 -1760 R0
WINDOW 123 0 0 Left 0
WINDOW 39 0 0 Left 0
SYMATTR InstName VDD_L
SYMATTR Value 1.8
SYMBOL res 3024 -1728 R90
WINDOW 0 0 56 VBottom 2
WINDOW 3 32 56 VTop 2
SYMATTR InstName Rfb3
SYMATTR Value {Rfb}
SYMBOL res 3024 -1168 R90
WINDOW 0 0 56 VBottom 2
WINDOW 3 32 56 VTop 2
SYMATTR InstName Rfb4
SYMATTR Value {Rfb}
SYMBOL cap 3008 -1920 R90
WINDOW 0 0 32 VBottom 2
WINDOW 3 32 32 VTop 2
SYMATTR InstName Cfb3
SYMATTR Value {Cfb}
SYMBOL cap 3008 -992 R90
WINDOW 0 0 32 VBottom 2
WINDOW 3 32 32 VTop 2
SYMATTR InstName Cfb4
SYMATTR Value {Cfb}
SYMBOL cap 3392 -1744 R0
SYMATTR InstName C9
SYMATTR Value {Cload}
SYMBOL cap 3392 -1216 R0
SYMATTR InstName C10
SYMATTR Value {Cload}
SYMBOL cap -32 -1744 R0
SYMATTR InstName C15
SYMATTR Value {C_big}
SYMBOL cap -64 -1104 R0
SYMATTR InstName C16
SYMATTR Value {C_big}
SYMBOL res 2128 -2560 R90
WINDOW 0 0 56 VBottom 2
WINDOW 3 32 56 VTop 2
SYMATTR InstName Rbig3
SYMATTR Value {Rbig}
SYMBOL res 2384 -2560 R90
WINDOW 0 0 56 VBottom 2
WINDOW 3 32 56 VTop 2
SYMATTR InstName Rbig4
SYMATTR Value {Rbig}
SYMBOL cap 1952 -2464 R0
SYMATTR InstName Ccm3
SYMATTR Value {Ccm}
SYMBOL cap 2400 -2464 R0
SYMATTR InstName Ccm4
SYMATTR Value {Ccm}
SYMBOL e 528 -2416 R90
WINDOW 0 15 -9 VRight 2
WINDOW 3 49 19 VRight 2
SYMATTR InstName E3
SYMATTR Value {Aadd/2}
SYMBOL e 784 -2416 R90
WINDOW 0 14 -9 VRight 2
WINDOW 3 45 7 VRight 2
SYMATTR InstName E4
SYMATTR Value {Aadd/2}
SYMBOL bv 2192 -2480 R0
SYMATTR InstName B2
SYMATTR Value V=0.9-V(Vbn_L)
SYMBOL e 608 -2336 R0
SYMATTR InstName E6
SYMATTR Value 1
SYMBOL e 1328 -2432 M270
WINDOW 0 15 -9 VRight 2
WINDOW 3 49 19 VRight 2
SYMATTR InstName E10
SYMATTR Value {Aadd/2}
SYMBOL e 1584 -2432 M270
WINDOW 0 14 -9 VRight 2
WINDOW 3 45 7 VRight 2
SYMATTR InstName E11
SYMATTR Value {Aadd/2}
SYMBOL e 1408 -2512 M180
SYMATTR InstName E12
SYMATTR Value 1
SYMBOL ind 3360 240 R0
SYMATTR InstName L1
SYMATTR Value {Lbig}
SYMBOL ind 3360 -240 R0
SYMATTR InstName L2
SYMATTR Value {Lbig}
SYMBOL voltage 3296 -32 R90
WINDOW 0 -32 56 VBottom 2
WINDOW 3 -4 56 VBottom 2
WINDOW 123 64 54 VBottom 2
WINDOW 39 0 0 Left 0
SYMATTR InstName V1
SYMATTR Value 0
SYMATTR Value2 AC 0.5 180
SYMBOL voltage 3296 144 R90
WINDOW 0 -32 56 VBottom 2
WINDOW 3 70 54 VTop 2
WINDOW 123 42 54 VTop 2
WINDOW 39 0 0 Left 0
SYMATTR InstName V2
SYMATTR Value 0
SYMATTR Value2 AC 0.5 0
SYMBOL voltage 3120 64 R90
WINDOW 0 -32 56 VBottom 2
WINDOW 3 32 56 VTop 2
WINDOW 123 0 0 Left 0
WINDOW 39 0 0 Left 0
SYMATTR InstName V3
SYMATTR Value 0.9
SYMBOL voltage 2832 64 R90
WINDOW 0 -32 56 VBottom 2
WINDOW 3 32 56 VTop 2
WINDOW 123 0 0 Left 0
WINDOW 39 0 0 Left 0
SYMATTR InstName V4
SYMATTR Value 0.9
SYMBOL e 4416 0 R0
SYMATTR InstName E13
SYMATTR Value 1
SYMBOL e 4640 0 R0
SYMATTR InstName E14
SYMATTR Value 1
TEXT 3192 -608 Left 2 !.lib 'C:\\Programs\\LTspice\\lib\\cmp\\logic018 no1of_CMOS1_2026.l' TT
TEXT -1168 -624 Left 2 ;Biasing circuit
TEXT 1368 744 Left 2 ;IDEAL CMFB
TEXT -304 968 Left 2 ;+
TEXT -40 976 Left 2 ;-
TEXT -296 744 Left 2 ;Gain-Boosting PMOS
TEXT 1520 -296 Left 2 ;Gain-Boosting
TEXT 1576 -224 Left 2 ;PMOS
TEXT 1528 -112 Left 2 ;IDEAL CMFB
TEXT 1520 176 Left 2 ;Gain-Boosting
TEXT 1568 248 Left 2 ;NMOS
TEXT 1128 -632 Left 2 ;Amplifier
TEXT 2480 -480 Left 2 ;Opamp
TEXT 2480 -344 Left 2 !.param Cin=Cload
TEXT 2480 -312 Left 2 !.param Cfb=Cin/Acl
TEXT 2480 -280 Left 2 !.param Cload=26.821p
TEXT 2480 -408 Left 2 !.param Rin=100G
TEXT 2480 -376 Left 2 !.param Rfb=Acl*Rin
TEXT 2480 -440 Left 2 !.param Acl=8
TEXT -1184 -584 Left 2 !.param Ibmain=800u
TEXT -1184 -552 Left 2 !.param Mp=36
TEXT -1184 -520 Left 2 !.param Mn=15.17
TEXT 112 672 Left 2 !.param Aadd=100
TEXT 496 1224 Left 2 ;+
TEXT 760 1216 Left 2 ;-
TEXT 560 744 Left 2 ;Gain-Boosting NMOS
TEXT 112 704 Left 2 !.param Rbig=1000G
TEXT 112 736 Left 2 !.param Ccm=Cin/Acl
TEXT -1184 -488 Left 2 !.param C_big=1u
TEXT 504 -624 Left 2 !.param scaleA=.4707
TEXT 504 -584 Left 2 !.param mn12={4*scaleA}
TEXT 504 -544 Left 2 !.param mn5678={2*scaleA}
TEXT 504 -424 Left 2 !.param mp13={4*scaleA*ratio}
TEXT 504 -464 Left 2 !.param ratio={Mp/Mn}
TEXT 504 -376 Left 2 !.param mp24={2*scaleA*ratio}
TEXT 504 -504 Left 2 !.param mn34={2500*scaleA}
TEXT 520 -304 Left 2 ;design_number 70
TEXT 520 -264 Left 2 ;Asettle 54dB
TEXT 520 -224 Left 2 ;Tsettle 1.11us
TEXT 520 -184 Left 2 ;SNR 83.6dB
TEXT 520 -152 Left 2 ;Bonus 0.05dB
TEXT -1184 -2032 Left 2 ;Load biasing circuit
TEXT 1360 -1704 Left 2 ;Gain-Boosting
TEXT 1416 -1632 Left 2 ;PMOS
TEXT 1368 -1552 Left 2 ;IDEAL CMFB
TEXT 1360 -1232 Left 2 ;Gain-Boosting
TEXT 1408 -1160 Left 2 ;NMOS
TEXT 1112 -2040 Left 2 ;Load Amplifier
TEXT 2384 -2040 Left 2 ;Load Opamp
TEXT 2136 -2776 Left 2 ;IDEAL CMFB
TEXT 464 -2552 Left 2 ;+
TEXT 728 -2544 Left 2 ;-
TEXT 472 -2776 Left 2 ;Gain-Boosting PMOS
TEXT 1264 -2296 Left 2 ;+
TEXT 1528 -2304 Left 2 ;-
TEXT 1328 -2776 Left 2 ;Gain-Boosting NMOS
TEXT -1256 -2864 Left 2 ;Load
TEXT 2488 -248 Left 2 !.param Lbig=1000g
TEXT 3200 -568 Left 2 !.ac dec 1000 1 100G
TEXT 3200 -528 Left 2 !.options logopinfo
TEXT 3208 -496 Left 2 ;.op
LINE Normal 3456 224 3456 -144 2
LINE Normal 3456 288 3456 224 2
LINE Normal 3840 64 3456 -144 2
LINE Normal 3456 288 3840 64 2
LINE Normal 2768 -1280 2768 -1648 2
LINE Normal 2768 -1216 2768 -1280 2
LINE Normal 3152 -1440 2768 -1648 2
LINE Normal 2768 -1216 3152 -1440 2
RECTANGLE Normal 1696 1248 1168 864
RECTANGLE Normal 1712 -176 1488 -384 2
RECTANGLE Normal 1712 272 1488 64 2
RECTANGLE Normal 1712 -16 1488 -144 2
RECTANGLE Normal -1200 576 432 -656
RECTANGLE Normal 80 1328 -432 864
RECTANGLE Normal 880 864 368 1328
RECTANGLE Normal 1808 1472 -560 640
RECTANGLE Normal 2336 576 480 -656
RECTANGLE Normal 1552 -1584 1328 -1792 2
RECTANGLE Normal 1552 -1136 1328 -1344 2
RECTANGLE Normal 3776 -832 2368 -2064
RECTANGLE Normal -1216 -832 416 -2064
RECTANGLE Normal 2320 -832 464 -2064
RECTANGLE Normal 2464 -2272 1936 -2656
RECTANGLE Normal 848 -2192 336 -2656
RECTANGLE Normal 1648 -2656 1136 -2192
RECTANGLE Normal 3872 -768 -1312 -2912
RECTANGLE Normal 1552 -1408 1328 -1568 2
RECTANGLE Normal 4720 656 2384 -656

The netlist it stands for:
* A_Ab.asc
Mn3 Vcn Vcn 0 0 nch l=.18u w=1u m={Mn}
Mn1 Vsn Vbn 0 0 nch l=.18u w=1u m={Mn}
Mn2 Vbn Vcn Vsn 0 nch l=.18u w=1u m={Mn}
Mp3 Vcp Vcp VDDB VDDB pch l=.18u w=1u m={Mp}
Mp1 Vsp Vbp VDDB VDDB pch l=.18u w=1u m={Mp}
Mp2 Vbp Vcp Vsp VDDB pch l=.18u w=1u m={Mp}
Ibpcas Vcp 0 {4.66*Ibmain}
Ibncas VDDB Vcn {4.86*Ibmain}
Ibmain Vbp Vbn {Ibmain}
C1 VDDB Vbp {C_big}
C2 VDDB Vcp {C_big}
C3 Vbn 0 {C_big}
C4 Vcn 0 {C_big}
Rbig1 N010 Vout+ {Rbig}
Rbig2 Vout- N010 {Rbig}
Ccm1 Vout+ Vbcm {Ccm}
Ccm2 Vout- Vbcm {Ccm}
E1 N012 Vg4 Vpp Vpn {Aadd/2}
E2 Vg2 N012 Vpp Vpn {Aadd/2}
MpA1 Vpn Vbp VDD VDD pch l=.18u w=1u m={mp13}
MpA3 Vpp Vbp VDD VDD pch l=.18u w=1u m={mp13}
MpA2 Vout- Vg2 Vpn VDD pch l=.18u w=1u m={mp24}
MpA4 Vout+ Vg4 Vpp VDD pch l=.18u w=1u m={mp24}
MnA7 Vnp Vbcm 0 0 nch l=.18u w=1u m={mn5678}
MnA5 Vnn Vbcm 0 0 nch l=.18u w=1u m={mn5678}
MnA1 N009 Vbn 0 0 nch l=.18u w=1u m={mn12}
MnA6 Vout- Vg6 Vnn 0 nch l=.18u w=1u m={mn5678}
MnA8 Vout+ Vg8 Vnp 0 nch l=.18u w=1u m={mn5678}
MnA2 N007 Vcn N009 0 nch l=.18u w=1u m={mn12}
MnA4 Vpp Vin- N007 0 nch l=.18u w=1u m={mn34}
MnA3 Vpn Vin+ N007 0 nch l=.18u w=1u m={mn34}
VDDB VDDB 0 1.8
VDD VDD 0 1.8
Rin1 Vinp+ N006 {Rin}
Rfb1 Vout+ Vinp+ {Rfb}
Rin2 Vinp- N006 {Rin}
Rfb2 Vout- Vinp- {Rfb}
Cin1 Vinp+ N006 {Cin}
Cfb1 Vout+ Vinp+ {Cfb}
Cin2 Vinp- N006 {Cin}
Cfb2 Vout- Vinp- {Cfb}
C11 0 Vout+ {Cload}
C12 Vout- 0 {Cload}
C13 VDDB Vsp {C_big}
C14 Vsn 0 {C_big}
B1 N010 Vbcm V=0.9-V(Vbn)
E5 N012 0 Vcp 0 1
E7 N011 Vg8 Vnp Vnn {Aadd/2}
E8 Vg6 N011 Vnp Vnn {Aadd/2}
E9 N011 0 Vcn 0 1
Mn9 Vcn_L Vcn_L 0 0 nch l=.18u w=1u m={Mn}
Mn10 Vsn_L Vbn_L 0 0 nch l=.18u w=1u m={Mn}
Mn11 Vbn_L Vcn_L Vsn_L 0 nch l=.18u w=1u m={Mn}
Mp5 Vcp_L Vcp_L VDDB_L VDDB pch l=.18u w=1u m={Mp}
Mp6 Vsp_L Vbp_L VDDB_L VDDB pch l=.18u w=1u m={Mp}
Mp7 Vbp_L Vcp_L Vsp_L VDDB pch l=.18u w=1u m={Mp}
Ibpcas1 Vcp_L 0 {6.3*Ibmain}
Ibncas1 VDDB_L Vcn_L {4.95*Ibmain}
Ibmain1 Vbp_L Vbn_L {Ibmain}
C5 VDDB_L Vbp_L {C_big}
C6 VDDB_L Vcp_L {C_big}
C7 Vbn_L 0 {C_big}
C8 Vcn_L 0 {C_big}
Mp8 Vpn_L Vbp_L VDD_L VDD pch l=.18u w=1u m={mp13}
Mp9 Vpp_L Vbp_L VDD_L VDD pch l=.18u w=1u m={mp13}
Mp10 Vout+_L Vg2_L Vpn_L VDD pch l=.18u w=1u m={mp24}
Mp11 Vout+_L Vg4_L Vpp_L VDD pch l=.18u w=1u m={mp24}
Mn12 Vnp_L Vbcm_L 0 0 nch l=.18u w=1u m={mn5678}
Mn13 Vnn_L Vbcm_L 0 0 nch l=.18u w=1u m={mn5678}
Mn14 N005 Vbn_L 0 0 nch l=.18u w=1u m={mn12}
Mn15 Vout+_L Vg6_L Vnn_L 0 nch l=.18u w=1u m={mn5678}
Mn16 Vout+_L Vg8_L Vnp_L 0 nch l=.18u w=1u m={mn5678}
Mn17 N004 Vcn_L N005 0 nch l=.18u w=1u m={mn12}
Mn18 Vpp_L Vin-_L N004 0 nch l=.18u w=1u m={mn34}
Mn19 Vpn_L Vin+_L N004 0 nch l=.18u w=1u m={mn34}
VDDB_L VDDB_L 0 1.8
VDD_L VDD_L 0 1.8
Rfb3 Vout+_L Vin-_L {Rfb}
Rfb4 Vout+_L Vin+_L {Rfb}
Cfb3 Vout+_L Vin-_L {Cfb}
Cfb4 Vout+_L Vin+_L {Cfb}
C9 0 Vout+_L {Cload}
C10 Vout+_L 0 {Cload}
C15 VDDB_L Vsp_L {C_big}
C16 Vsn_L 0 {C_big}
Rbig3 N001 Vout+_L {Rbig}
Rbig4 Vout+_L N001 {Rbig}
Ccm3 Vout+_L Vbcm_L {Ccm}
Ccm4 Vout+_L Vbcm_L {Ccm}
E3 N003 Vg4_L Vpp_L Vpn_L {Aadd/2}
E4 Vg2_L N003 Vpp_L Vpn_L {Aadd/2}
B2 N001 Vbcm_L V=0.9-V(Vbn_L)
E6 N003 0 Vcp_L 0 1
E10 N002 Vg8_L Vnp_L Vnn_L {Aadd/2}
E11 Vg6_L N002 Vnp_L Vnn_L {Aadd/2}
E12 N002 0 Vcn 0 1
L1 Vin+ Vinp- {Lbig}
L2 Vinp+ Vin- {Lbig}
V1 Vin- N008 0 AC 0.5 180
V2 Vin+ N008 0 AC 0.5 0
V3 N008 0 0.9
V4 N006 0 0.9
E13 A 0 Vout+ Vout- 1
E14 Ab 0 Vinp+ Vinp- 1
.model NMOS NMOS
.model PMOS PMOS
.lib standard.mos
.lib 'C:\Programs\LTspice\lib\cmp\logic018 no1of_CMOS1_2026.l' TT
* Biasing circuit
* IDEAL CMFB
* +
* -
* Gain-Boosting PMOS
* Gain-Boosting
* PMOS
* IDEAL CMFB
* Gain-Boosting
* NMOS
* Amplifier
* Opamp
.param Cin=Cload
.param Cfb=Cin/Acl
.param Cload=26.821p
.param Rin=100G
.param Rfb=Acl*Rin
.param Acl=8
.param Ibmain=800u
.param Mp=36
.param Mn=15.17
.param Aadd=100
* +
* -
* Gain-Boosting NMOS
.param Rbig=1000G
.param Ccm=Cin/Acl
.param C_big=1u
.param scaleA=.4707
.param mn12={4*scaleA}
.param mn5678={2*scaleA}
.param mp13={4*scaleA*ratio}
.param ratio={Mp/Mn}
.param mp24={2*scaleA*ratio}
.param mn34={2500*scaleA}
* design_number 70
* Asettle 54dB
* Tsettle 1.11us
* SNR 83.6dB
* Bonus 0.05dB
* Load biasing circuit
* Gain-Boosting
* PMOS
* IDEAL CMFB
* Gain-Boosting
* NMOS
* Load Amplifier
* Load Opamp
* IDEAL CMFB
* +
* -
* Gain-Boosting PMOS
* +
* -
* Gain-Boosting NMOS
* Load
.param Lbig=1000g
.ac dec 1000 1 100G
.options logopinfo
* .op
.backanno
.end